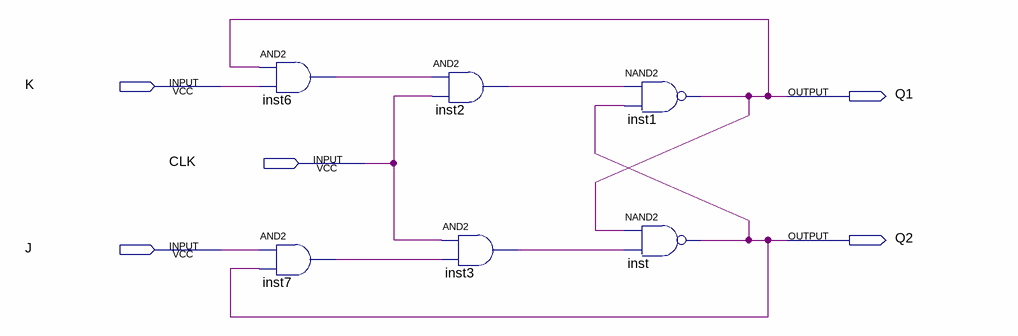
[diagram p0: schematic sheet]
// Quartus schematic flipflop_JK.bdf as structural Verilog: 6 symbols, 5 pins
module flipflop_JK (
  input  K,
  input  CLK,
  input  J,
  output Q1,
  output Q2
);

  wire inst2_out, inst3_out, inst6_out, inst7_out;

  and inst6 (inst6_out, Q1, K);
  and inst7 (inst7_out, J, Q2);
  and inst2 (inst2_out, inst6_out, CLK);
  and inst3 (inst3_out, CLK, inst7_out);
  nand inst1 (Q1, inst2_out, Q2);
  nand inst (Q2, Q1, inst3_out);
endmodule
